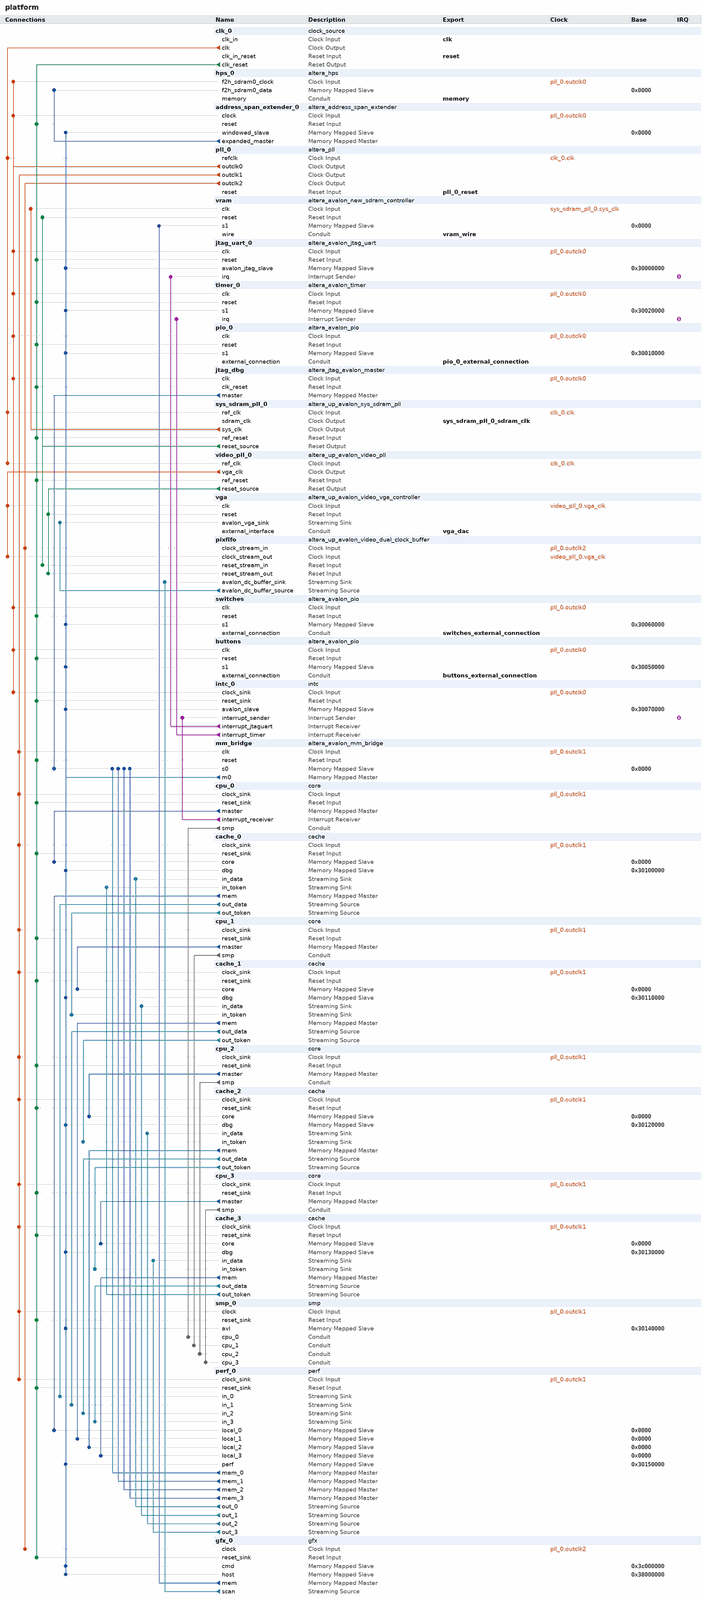
[diagram p0: system contents, whole]
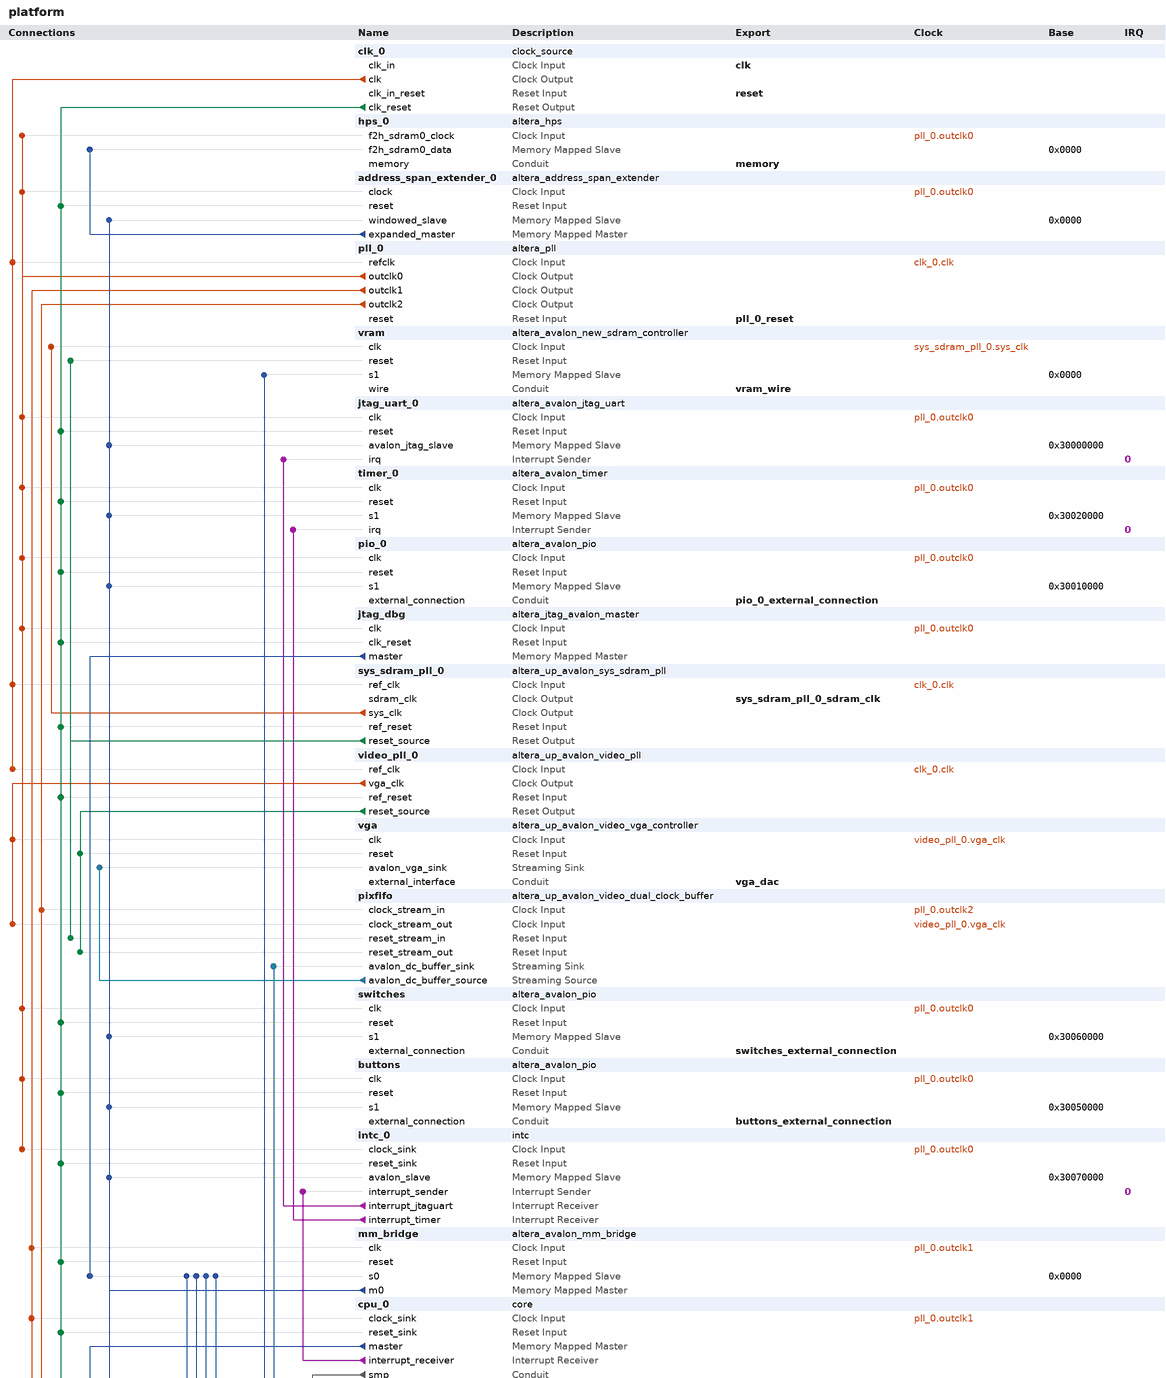
[diagram p1: system contents, upper part]
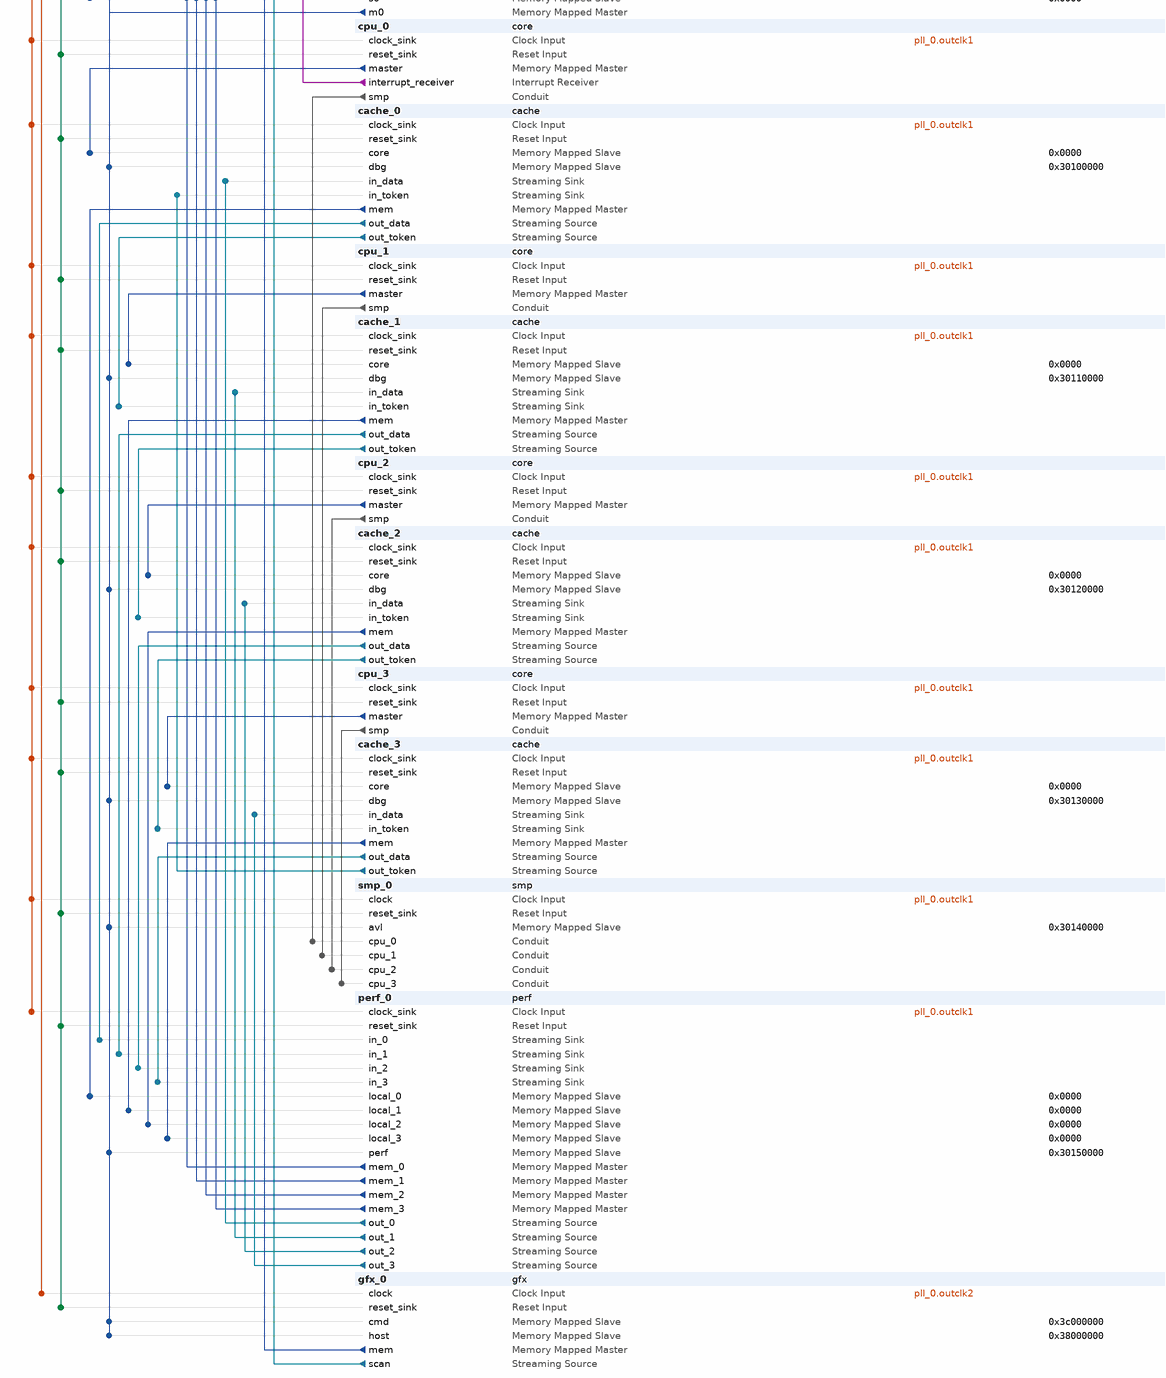
[diagram p2: system contents, lower part]
# Platform Designer (Qsys) system platform, Cyclone V 5CSEMA5F31C6
# Parameters at their usual value, and those the tool derives, are not listed.
package require -exact qsys 20.1
create_system platform
set_project_property DEVICE_FAMILY {Cyclone V}
set_project_property DEVICE 5CSEMA5F31C6

add_instance clk_0 clock_source 20.1
set_instance_parameter_value clk_0 clockFrequency 50000000

add_instance hps_0 altera_hps 20.1
set_instance_parameter_value hps_0 EMAC1_Mode N/A
set_instance_parameter_value hps_0 EMAC1_PinMuxing Unused
set_instance_parameter_value hps_0 F2SCLK_COLDRST_Enable false
set_instance_parameter_value hps_0 F2SCLK_DBGRST_Enable false
set_instance_parameter_value hps_0 F2SCLK_WARMRST_Enable false
set_instance_parameter_value hps_0 F2SDRAM_Type {Avalon-MM Bidirectional}
set_instance_parameter_value hps_0 F2SDRAM_Width 128
set_instance_parameter_value hps_0 F2SINTERRUPT_Enable false
set_instance_parameter_value hps_0 F2S_Width 0
set_instance_parameter_value hps_0 FPGA_PERIPHERAL_OUTPUT_CLOCK_FREQ_EMAC0_GTX_CLK 125
set_instance_parameter_value hps_0 FPGA_PERIPHERAL_OUTPUT_CLOCK_FREQ_EMAC0_MD_CLK 2.5
set_instance_parameter_value hps_0 FPGA_PERIPHERAL_OUTPUT_CLOCK_FREQ_EMAC1_GTX_CLK 125
set_instance_parameter_value hps_0 FPGA_PERIPHERAL_OUTPUT_CLOCK_FREQ_EMAC1_MD_CLK 2.5
set_instance_parameter_value hps_0 HPS_PROTOCOL DDR3
set_instance_parameter_value hps_0 I2C0_Mode N/A
set_instance_parameter_value hps_0 I2C0_PinMuxing Unused
set_instance_parameter_value hps_0 I2C1_Mode N/A
set_instance_parameter_value hps_0 I2C1_PinMuxing Unused
set_instance_parameter_value hps_0 LWH2F_Enable false
set_instance_parameter_value hps_0 MEM_BANKADDR_WIDTH 3
set_instance_parameter_value hps_0 MEM_CLK_FREQ 300.0
set_instance_parameter_value hps_0 MEM_CLK_FREQ_MAX 400.0
set_instance_parameter_value hps_0 MEM_COL_ADDR_WIDTH 8
set_instance_parameter_value hps_0 MEM_DQ_WIDTH 8
set_instance_parameter_value hps_0 MEM_DRV_STR RZQ/6
set_instance_parameter_value hps_0 MEM_ROW_ADDR_WIDTH 12
set_instance_parameter_value hps_0 MEM_RTT_NOM {ODT Disabled}
set_instance_parameter_value hps_0 MEM_RTT_WR {Dynamic ODT off}
set_instance_parameter_value hps_0 MEM_TCL 7
set_instance_parameter_value hps_0 MEM_TFAW_NS 37.5
set_instance_parameter_value hps_0 MEM_TINIT_US 499
set_instance_parameter_value hps_0 MEM_TMRD_CK 3
set_instance_parameter_value hps_0 MEM_TRAS_NS 40.0
set_instance_parameter_value hps_0 MEM_TRCD_NS 15.0
set_instance_parameter_value hps_0 MEM_TREFI_US 7.0
set_instance_parameter_value hps_0 MEM_TRFC_NS 75.0
set_instance_parameter_value hps_0 MEM_TRP_NS 15.0
set_instance_parameter_value hps_0 MEM_TWTR 2
set_instance_parameter_value hps_0 MEM_VENDOR JEDEC
set_instance_parameter_value hps_0 MEM_WTCL 6
set_instance_parameter_value hps_0 QSPI_Mode N/A
set_instance_parameter_value hps_0 QSPI_PinMuxing Unused
set_instance_parameter_value hps_0 REF_CLK_FREQ 125.0
set_instance_parameter_value hps_0 S2FCLK_USER2CLK 5
set_instance_parameter_value hps_0 S2F_Width 0
set_instance_parameter_value hps_0 SDIO_Mode N/A
set_instance_parameter_value hps_0 SDIO_PinMuxing Unused
set_instance_parameter_value hps_0 SPIM1_Mode N/A
set_instance_parameter_value hps_0 SPIM1_PinMuxing Unused
set_instance_parameter_value hps_0 STM_Enable false
set_instance_parameter_value hps_0 TIMING_BOARD_AC_SKEW 0.02
set_instance_parameter_value hps_0 TIMING_BOARD_AC_TO_CK_SKEW 0.0
set_instance_parameter_value hps_0 TIMING_BOARD_DQ_TO_DQS_SKEW 0.0
set_instance_parameter_value hps_0 TIMING_BOARD_MAX_CK_DELAY 0.6
set_instance_parameter_value hps_0 TIMING_BOARD_MAX_DQS_DELAY 0.6
set_instance_parameter_value hps_0 TIMING_BOARD_SKEW_BETWEEN_DQS 0.02
set_instance_parameter_value hps_0 TIMING_BOARD_SKEW_CKDQS_DIMM_MAX 0.01
set_instance_parameter_value hps_0 TIMING_BOARD_SKEW_CKDQS_DIMM_MIN -0.01
set_instance_parameter_value hps_0 TIMING_BOARD_SKEW_WITHIN_DQS 0.02
set_instance_parameter_value hps_0 TIMING_TDH 125
set_instance_parameter_value hps_0 TIMING_TDQSCK 400
set_instance_parameter_value hps_0 TIMING_TDQSQ 120
set_instance_parameter_value hps_0 TIMING_TDS 50
set_instance_parameter_value hps_0 TIMING_TIH 250
set_instance_parameter_value hps_0 TIMING_TIS 175
set_instance_parameter_value hps_0 TIMING_TQSH 0.38
set_instance_parameter_value hps_0 UART0_Mode N/A
set_instance_parameter_value hps_0 UART0_PinMuxing Unused
set_instance_parameter_value hps_0 USB1_Mode N/A
set_instance_parameter_value hps_0 USB1_PinMuxing Unused
set_instance_parameter_value hps_0 desired_cfg_clk_mhz 100.0
set_instance_parameter_value hps_0 desired_qspi_clk_mhz 400.0

add_instance address_span_extender_0 altera_address_span_extender 20.1
set_instance_parameter_value address_span_extender_0 BURSTCOUNT_WIDTH 1
set_instance_parameter_value address_span_extender_0 DATA_WIDTH 32
set_instance_parameter_value address_span_extender_0 ENABLE_SLAVE_PORT false
set_instance_parameter_value address_span_extender_0 MASTER_ADDRESS_DEF 536870912
set_instance_parameter_value address_span_extender_0 MAX_PENDING_READS 1
set_instance_parameter_value address_span_extender_0 SLAVE_ADDRESS_WIDTH 27

add_instance pll_0 altera_pll 20.1
set_instance_parameter_value pll_0 gui_actual_output_clock_frequency2 {120.000000 MHz}
set_instance_parameter_value pll_0 gui_device_speed_grade 1
set_instance_parameter_value pll_0 gui_number_of_clocks 3
set_instance_parameter_value pll_0 gui_operation_mode direct
set_instance_parameter_value pll_0 gui_output_clock_frequency0 50.0
set_instance_parameter_value pll_0 gui_output_clock_frequency1 80.0
set_instance_parameter_value pll_0 gui_output_clock_frequency2 120.0
set_instance_parameter_value pll_0 gui_pll_auto_reset On
set_instance_parameter_value pll_0 gui_pll_mode {Fractional-N PLL}
set_instance_parameter_value pll_0 gui_reference_clock_frequency 50.0
set_instance_parameter_value pll_0 gui_use_locked false

add_instance vram altera_avalon_new_sdram_controller 20.1
set_instance_parameter_value vram TAC 5.4
set_instance_parameter_value vram TRCD 15.0
set_instance_parameter_value vram TRP 15.0
set_instance_parameter_value vram casLatency 3
set_instance_parameter_value vram columnWidth 10
set_instance_parameter_value vram dataWidth 16
set_instance_parameter_value vram generateSimulationModel false
set_instance_parameter_value vram model single_Micron_MT48LC4M32B2_7_chip
set_instance_parameter_value vram numberOfBanks 4
set_instance_parameter_value vram numberOfChipSelects 1
set_instance_parameter_value vram powerUpDelay 100.0
set_instance_parameter_value vram refreshPeriod 7.8125
set_instance_parameter_value vram rowWidth 13

add_instance jtag_uart_0 altera_avalon_jtag_uart 20.1
set_instance_parameter_value jtag_uart_0 simInteractiveOptions NO_INTERACTIVE_WINDOWS

add_instance timer_0 altera_avalon_timer 20.1
set_instance_parameter_value timer_0 period 1
set_instance_parameter_value timer_0 periodUnits MSEC

add_instance pio_0 altera_avalon_pio 20.1
set_instance_parameter_value pio_0 bitModifyingOutReg true
set_instance_parameter_value pio_0 direction Output
set_instance_parameter_value pio_0 width 8

add_instance jtag_dbg altera_jtag_avalon_master 20.1

add_instance sys_sdram_pll_0 altera_up_avalon_sys_sdram_pll 18.0
set_instance_parameter_value sys_sdram_pll_0 CV_boards DE1-SoC
set_instance_parameter_value sys_sdram_pll_0 gui_outclk 143.0
set_instance_parameter_value sys_sdram_pll_0 gui_refclk 50.0

add_instance video_pll_0 altera_up_avalon_video_pll 18.0
set_instance_parameter_value video_pll_0 camera {5MP Digital Camera (THDB_D5M)}
set_instance_parameter_value video_pll_0 gui_refclk 50.0
set_instance_parameter_value video_pll_0 lcd {7" LCD on VEEK-MT and MTL/MTL2 Modules}

add_instance vga altera_up_avalon_video_vga_controller 18.0
set_instance_parameter_value vga board DE1-SoC
set_instance_parameter_value vga resolution {VGA 640x480}

add_instance pixfifo altera_up_avalon_video_dual_clock_buffer 18.0
set_instance_parameter_value pixfifo color_bits 10

add_instance switches altera_avalon_pio 20.1
set_instance_parameter_value switches direction Input
set_instance_parameter_value switches width 8

add_instance buttons altera_avalon_pio 20.1
set_instance_parameter_value buttons direction Input
set_instance_parameter_value buttons width 8

add_instance intc_0 intc 1.0

add_instance mm_bridge altera_avalon_mm_bridge 20.1
set_instance_parameter_value mm_bridge ADDRESS_UNITS SYMBOLS
set_instance_parameter_value mm_bridge ADDRESS_WIDTH 32
set_instance_parameter_value mm_bridge DATA_WIDTH 128
set_instance_parameter_value mm_bridge MAX_PENDING_RESPONSES 4
set_instance_parameter_value mm_bridge USE_AUTO_ADDRESS_WIDTH 0

add_instance cpu_0 core 1.0
set_instance_parameter_value cpu_0 ID 0

add_instance cache_0 cache 1.0
set_instance_parameter_value cache_0 ID 0

add_instance cpu_1 core 1.0
set_instance_parameter_value cpu_1 ID 1

add_instance cache_1 cache 1.0
set_instance_parameter_value cache_1 ID 1

add_instance cpu_2 core 1.0
set_instance_parameter_value cpu_2 ID 2

add_instance cache_2 cache 1.0
set_instance_parameter_value cache_2 ID 2

add_instance cpu_3 core 1.0
set_instance_parameter_value cpu_3 ID 3

add_instance cache_3 cache 1.0
set_instance_parameter_value cache_3 ID 3

add_instance smp_0 smp 1.0

add_instance perf_0 perf 1.0

add_instance gfx_0 gfx 1.0

# connections
add_connection clk_0.clk pll_0.refclk clock
add_connection clk_0.clk sys_sdram_pll_0.ref_clk clock
add_connection clk_0.clk video_pll_0.ref_clk clock
add_connection pll_0.outclk0 address_span_extender_0.clock clock
add_connection pll_0.outclk0 buttons.clk clock
add_connection pll_0.outclk0 hps_0.f2h_sdram0_clock clock
add_connection pll_0.outclk0 intc_0.clock_sink clock
add_connection pll_0.outclk0 jtag_dbg.clk clock
add_connection pll_0.outclk0 jtag_uart_0.clk clock
add_connection pll_0.outclk0 pio_0.clk clock
add_connection pll_0.outclk0 switches.clk clock
add_connection pll_0.outclk0 timer_0.clk clock
add_connection pll_0.outclk1 cache_0.clock_sink clock
add_connection pll_0.outclk1 cache_1.clock_sink clock
add_connection pll_0.outclk1 cache_2.clock_sink clock
add_connection pll_0.outclk1 cache_3.clock_sink clock
add_connection pll_0.outclk1 cpu_0.clock_sink clock
add_connection pll_0.outclk1 cpu_1.clock_sink clock
add_connection pll_0.outclk1 cpu_2.clock_sink clock
add_connection pll_0.outclk1 cpu_3.clock_sink clock
add_connection pll_0.outclk1 mm_bridge.clk clock
add_connection pll_0.outclk1 perf_0.clock_sink clock
add_connection pll_0.outclk1 smp_0.clock clock
add_connection pll_0.outclk2 gfx_0.clock clock
add_connection pll_0.outclk2 pixfifo.clock_stream_in clock
add_connection sys_sdram_pll_0.sys_clk vram.clk clock
add_connection video_pll_0.vga_clk pixfifo.clock_stream_out clock
add_connection video_pll_0.vga_clk vga.clk clock
add_connection clk_0.clk_reset address_span_extender_0.reset reset
add_connection clk_0.clk_reset buttons.reset reset
add_connection clk_0.clk_reset cache_0.reset_sink reset
add_connection clk_0.clk_reset cache_1.reset_sink reset
add_connection clk_0.clk_reset cache_2.reset_sink reset
add_connection clk_0.clk_reset cache_3.reset_sink reset
add_connection clk_0.clk_reset cpu_0.reset_sink reset
add_connection clk_0.clk_reset cpu_1.reset_sink reset
add_connection clk_0.clk_reset cpu_2.reset_sink reset
add_connection clk_0.clk_reset cpu_3.reset_sink reset
add_connection clk_0.clk_reset gfx_0.reset_sink reset
add_connection clk_0.clk_reset intc_0.reset_sink reset
add_connection clk_0.clk_reset jtag_dbg.clk_reset reset
add_connection clk_0.clk_reset jtag_uart_0.reset reset
add_connection clk_0.clk_reset mm_bridge.reset reset
add_connection clk_0.clk_reset perf_0.reset_sink reset
add_connection clk_0.clk_reset pio_0.reset reset
add_connection clk_0.clk_reset smp_0.reset_sink reset
add_connection clk_0.clk_reset switches.reset reset
add_connection clk_0.clk_reset sys_sdram_pll_0.ref_reset reset
add_connection clk_0.clk_reset timer_0.reset reset
add_connection clk_0.clk_reset video_pll_0.ref_reset reset
add_connection sys_sdram_pll_0.reset_source pixfifo.reset_stream_in reset
add_connection sys_sdram_pll_0.reset_source vram.reset reset
add_connection video_pll_0.reset_source pixfifo.reset_stream_out reset
add_connection video_pll_0.reset_source vga.reset reset
add_connection address_span_extender_0.expanded_master hps_0.f2h_sdram0_data avalon
set_connection_parameter_value address_span_extender_0.expanded_master/hps_0.f2h_sdram0_data baseAddress 0x0000
add_connection cache_0.mem perf_0.local_0 avalon
set_connection_parameter_value cache_0.mem/perf_0.local_0 baseAddress 0x0000
add_connection cache_1.mem perf_0.local_1 avalon
set_connection_parameter_value cache_1.mem/perf_0.local_1 baseAddress 0x0000
add_connection cache_2.mem perf_0.local_2 avalon
set_connection_parameter_value cache_2.mem/perf_0.local_2 baseAddress 0x0000
add_connection cache_3.mem perf_0.local_3 avalon
set_connection_parameter_value cache_3.mem/perf_0.local_3 baseAddress 0x0000
add_connection cpu_0.master cache_0.core avalon
set_connection_parameter_value cpu_0.master/cache_0.core baseAddress 0x0000
add_connection cpu_1.master cache_1.core avalon
set_connection_parameter_value cpu_1.master/cache_1.core baseAddress 0x0000
add_connection cpu_2.master cache_2.core avalon
set_connection_parameter_value cpu_2.master/cache_2.core baseAddress 0x0000
add_connection cpu_3.master cache_3.core avalon
set_connection_parameter_value cpu_3.master/cache_3.core baseAddress 0x0000
add_connection gfx_0.mem vram.s1 avalon
set_connection_parameter_value gfx_0.mem/vram.s1 baseAddress 0x0000
add_connection jtag_dbg.master mm_bridge.s0 avalon
set_connection_parameter_value jtag_dbg.master/mm_bridge.s0 baseAddress 0x0000
add_connection mm_bridge.m0 address_span_extender_0.windowed_slave avalon
set_connection_parameter_value mm_bridge.m0/address_span_extender_0.windowed_slave baseAddress 0x0000
add_connection mm_bridge.m0 buttons.s1 avalon
set_connection_parameter_value mm_bridge.m0/buttons.s1 baseAddress 0x30050000
add_connection mm_bridge.m0 cache_0.dbg avalon
set_connection_parameter_value mm_bridge.m0/cache_0.dbg baseAddress 0x30100000
add_connection mm_bridge.m0 cache_1.dbg avalon
set_connection_parameter_value mm_bridge.m0/cache_1.dbg baseAddress 0x30110000
add_connection mm_bridge.m0 cache_2.dbg avalon
set_connection_parameter_value mm_bridge.m0/cache_2.dbg baseAddress 0x30120000
add_connection mm_bridge.m0 cache_3.dbg avalon
set_connection_parameter_value mm_bridge.m0/cache_3.dbg baseAddress 0x30130000
add_connection mm_bridge.m0 gfx_0.cmd avalon
set_connection_parameter_value mm_bridge.m0/gfx_0.cmd baseAddress 0x3c000000
add_connection mm_bridge.m0 gfx_0.host avalon
set_connection_parameter_value mm_bridge.m0/gfx_0.host baseAddress 0x38000000
add_connection mm_bridge.m0 intc_0.avalon_slave avalon
set_connection_parameter_value mm_bridge.m0/intc_0.avalon_slave baseAddress 0x30070000
add_connection mm_bridge.m0 jtag_uart_0.avalon_jtag_slave avalon
set_connection_parameter_value mm_bridge.m0/jtag_uart_0.avalon_jtag_slave baseAddress 0x30000000
add_connection mm_bridge.m0 perf_0.perf avalon
set_connection_parameter_value mm_bridge.m0/perf_0.perf baseAddress 0x30150000
add_connection mm_bridge.m0 pio_0.s1 avalon
set_connection_parameter_value mm_bridge.m0/pio_0.s1 baseAddress 0x30010000
add_connection mm_bridge.m0 smp_0.avl avalon
set_connection_parameter_value mm_bridge.m0/smp_0.avl baseAddress 0x30140000
add_connection mm_bridge.m0 switches.s1 avalon
set_connection_parameter_value mm_bridge.m0/switches.s1 baseAddress 0x30060000
add_connection mm_bridge.m0 timer_0.s1 avalon
set_connection_parameter_value mm_bridge.m0/timer_0.s1 baseAddress 0x30020000
add_connection perf_0.mem_0 mm_bridge.s0 avalon
set_connection_parameter_value perf_0.mem_0/mm_bridge.s0 baseAddress 0x0000
add_connection perf_0.mem_1 mm_bridge.s0 avalon
set_connection_parameter_value perf_0.mem_1/mm_bridge.s0 baseAddress 0x0000
add_connection perf_0.mem_2 mm_bridge.s0 avalon
set_connection_parameter_value perf_0.mem_2/mm_bridge.s0 baseAddress 0x0000
add_connection perf_0.mem_3 mm_bridge.s0 avalon
set_connection_parameter_value perf_0.mem_3/mm_bridge.s0 baseAddress 0x0000
add_connection cache_0.out_data perf_0.in_0 avalon_streaming
add_connection cache_0.out_token cache_1.in_token avalon_streaming
add_connection cache_1.out_data perf_0.in_1 avalon_streaming
add_connection cache_1.out_token cache_2.in_token avalon_streaming
add_connection cache_2.out_data perf_0.in_2 avalon_streaming
add_connection cache_2.out_token cache_3.in_token avalon_streaming
add_connection cache_3.out_data perf_0.in_3 avalon_streaming
add_connection cache_3.out_token cache_0.in_token avalon_streaming
add_connection gfx_0.scan pixfifo.avalon_dc_buffer_sink avalon_streaming
add_connection perf_0.out_0 cache_0.in_data avalon_streaming
add_connection perf_0.out_1 cache_1.in_data avalon_streaming
add_connection perf_0.out_2 cache_2.in_data avalon_streaming
add_connection perf_0.out_3 cache_3.in_data avalon_streaming
add_connection pixfifo.avalon_dc_buffer_source vga.avalon_vga_sink avalon_streaming
add_connection cpu_0.smp smp_0.cpu_0 conduit
add_connection cpu_1.smp smp_0.cpu_1 conduit
add_connection cpu_2.smp smp_0.cpu_2 conduit
add_connection cpu_3.smp smp_0.cpu_3 conduit
add_connection cpu_0.interrupt_receiver intc_0.interrupt_sender interrupt
set_connection_parameter_value cpu_0.interrupt_receiver/intc_0.interrupt_sender irqNumber 0
add_connection intc_0.interrupt_jtaguart jtag_uart_0.irq interrupt
set_connection_parameter_value intc_0.interrupt_jtaguart/jtag_uart_0.irq irqNumber 0
add_connection intc_0.interrupt_timer timer_0.irq interrupt
set_connection_parameter_value intc_0.interrupt_timer/timer_0.irq irqNumber 0

# exported interfaces
add_interface buttons_external_connection conduit end
set_interface_property buttons_external_connection EXPORT_OF buttons.external_connection
add_interface clk clock sink
set_interface_property clk EXPORT_OF clk_0.clk_in
add_interface memory conduit end
set_interface_property memory EXPORT_OF hps_0.memory
add_interface pio_0_external_connection conduit end
set_interface_property pio_0_external_connection EXPORT_OF pio_0.external_connection
add_interface pll_0_reset reset sink
set_interface_property pll_0_reset EXPORT_OF pll_0.reset
add_interface reset reset sink
set_interface_property reset EXPORT_OF clk_0.clk_in_reset
add_interface switches_external_connection conduit end
set_interface_property switches_external_connection EXPORT_OF switches.external_connection
add_interface sys_sdram_pll_0_sdram_clk clock source
set_interface_property sys_sdram_pll_0_sdram_clk EXPORT_OF sys_sdram_pll_0.sdram_clk
add_interface vga_dac conduit end
set_interface_property vga_dac EXPORT_OF vga.external_interface
add_interface vram_wire conduit end
set_interface_property vram_wire EXPORT_OF vram.wire

set_interconnect_requirement {$system} qsys_mm.clockCrossingAdapter HANDSHAKE
set_interconnect_requirement {$system} qsys_mm.enableEccProtection FALSE
set_interconnect_requirement {$system} qsys_mm.enableInstrumentation FALSE
set_interconnect_requirement {$system} qsys_mm.insertDefaultSlave FALSE
set_interconnect_requirement {$system} qsys_mm.maxAdditionalLatency 1

save_system platform.qsys
